# EAGLE design midi_block (EAGLE 6.6.0)
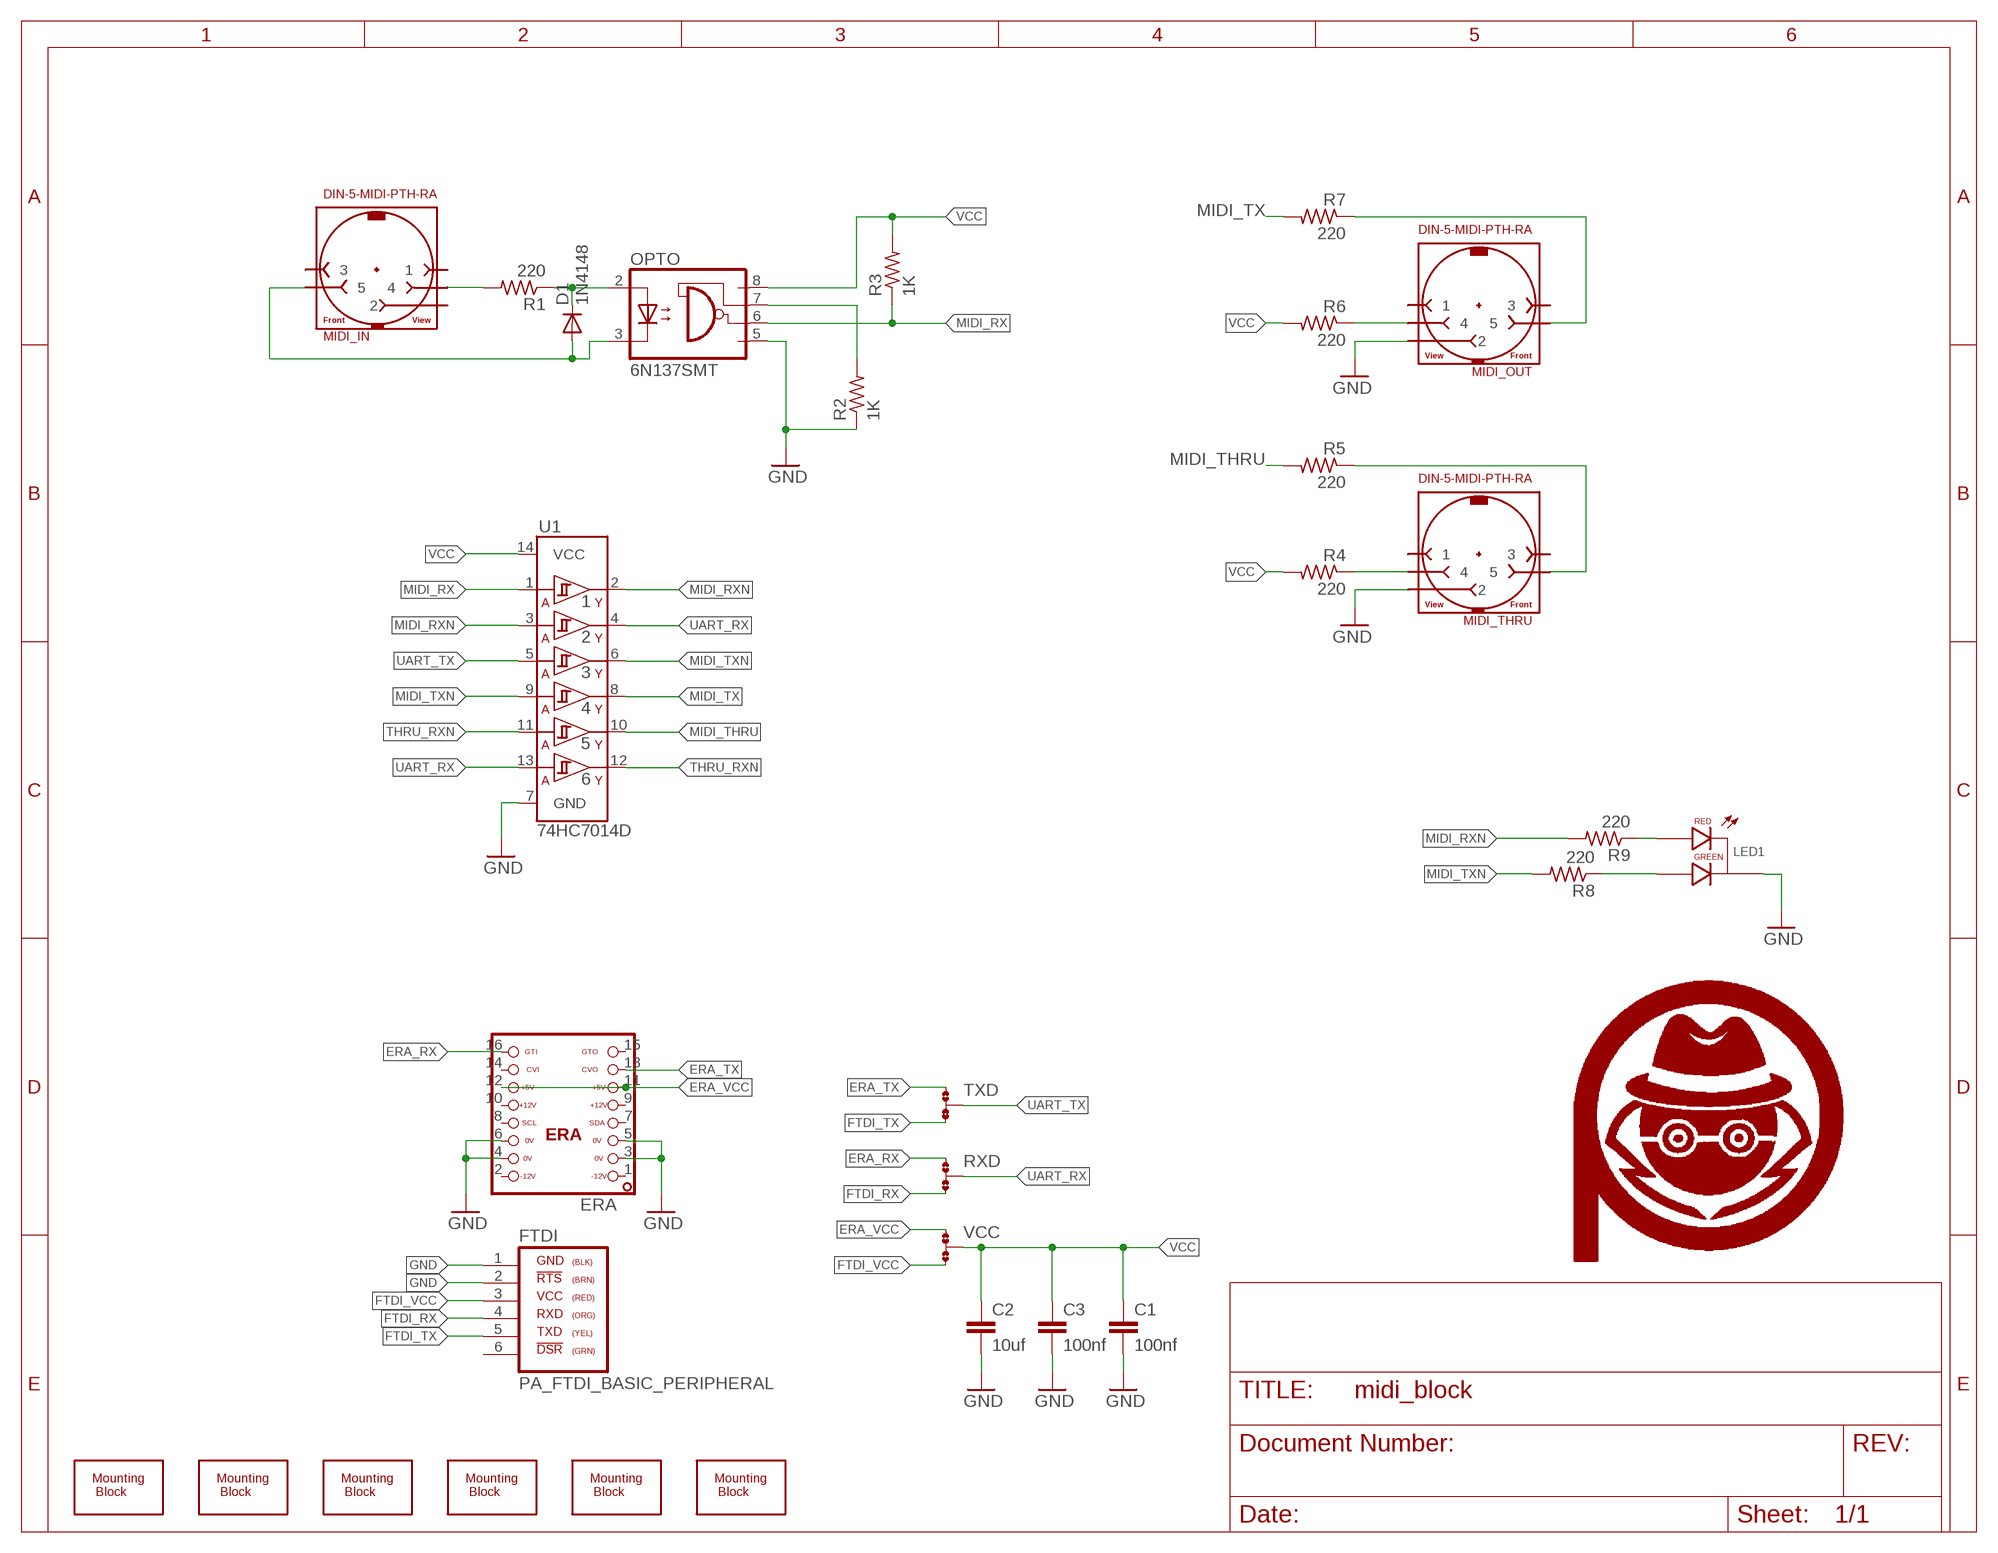
[diagram p0: schematic, sheet 1]

## Parts
C1  100nf  CAP0603-CAP  [0603-CAP]
C2  10uf  CAP0603-CAP  [0603-CAP]
C3  100nf  CAP0603-CAP  [0603-CAP]
D1  1N4148  DIODE-SOD323-W  [SOD323-W]
ERA  ERA-SHROUD  [ERA]
FTDI  PA_FTDI_BASIC_PERIPHERAL  [PA_PMOD_SIL_MALE]
LED1  LED-RG-CC-PTH-G18500  [LED-RG-PANEL]
MIDI_IN  DIN-5-MIDI-PTH-RA  [DIN-5-PTH-RA-SUPPORT]
MIDI_OUT  DIN-5-MIDI-PTH-RA  [DIN-5-PTH-RA-SUPPORT]
MIDI_THRU  DIN-5-MIDI-PTH-RA  [DIN-5-PTH-RA-SUPPORT]
OPTO  6N137SMT  [DIL8-SMD]
R1  220  R-US_R0603  [R0603]
R2  1K  R-US_R0603  [R0603]
R3  1K  R-US_R0603  [R0603]
R4  220  R-US_R0603  [R0603]
R5  220  R-US_R0603  [R0603]
R6  220  R-US_R0603  [R0603]
R7  220  R-US_R0603  [R0603]
R8  220  R-US_R0603  [R0603]
R9  220  R-US_R0603  [R0603]
RXD  JMP-3-NO-PTH  [JMP-3-NO-PTH-2.54]
TXD  JMP-3-NO-PTH  [JMP-3-NO-PTH-2.54]
U1  74HC7014D  [SOIC-14]
U$1  PCB-MB-SIDE  [PCB-MB-01-SIDE]
U$2  PCB-MB-SIDE  [PCB-MB-01-SIDE]
U$3  PCB-MB-SIDE  [PCB-MB-01-SIDE]
U$4  PCB-MB-SIDE  [PCB-MB-01-SIDE]
U$5  PA_LOGO_SYMMED  [PA_LOGO_AGENT_MED_SYM]
U$6  PA_LOGO_SYMMED  [PA_LOGO_AGENT_MED_SYM]
U$7  PCB-MB-SIDE  [PCB-MB-01-SIDE]
U$8  PCB-MB-SIDE  [PCB-MB-01-SIDE]
VCC  JMP-3-NO-PTH  [JMP-3-NO-PTH-2.54]

## Nets
CL_IN: MIDI_IN.4 R1.2
ERA_RX: ERA.16 RXD.1
ERA_TX: ERA.13 TXD.1
ERA_VCC: ERA.11 ERA.12 VCC.1
FTDI_RX: FTDI.4 RXD.3
FTDI_TX: FTDI.5 TXD.3
FTDI_VCC: FTDI.3 VCC.3
GND: C1.2 C2.2 C3.2 ERA.3 ERA.4 ERA.5 ERA.6 FTDI.1 FTDI.2 LED1.CC(CATHODE) MIDI_OUT.2 MIDI_THRU.2 OPTO.5(GND) R2.1 U1.7(GND)
MIDI_IN: D1.A MIDI_IN.5 OPTO.3(C)
MIDI_OUT: MIDI_OUT.5 R7.1
MIDI_OUT1: MIDI_THRU.5 R5.1
MIDI_RX: OPTO.6(VO) R3.1 U1.1(1A)
MIDI_RXN: R9.2 U1.2(1Y) U1.3(2A)
MIDI_THRU: R5.2 U1.10(5Y)
MIDI_TX: R7.2 U1.8(4Y)
MIDI_TXN: R8.2 U1.6(3Y) U1.9(4A)
N$1: LED1.RED(RED_CATHODE) R9.1
N$2: LED1.GREEN(GREEN_CATHODE) R8.1
N$3: MIDI_THRU.4 R4.1
N$4: OPTO.7(VE) R2.2
N$8: D1.C OPTO.2(A) R1.1
N$13: MIDI_OUT.4 R6.1
THRU_RXN: U1.11(5A) U1.12(6Y)
UART_RX: RXD.2 U1.4(2Y) U1.13(6A)
UART_TX: TXD.2 U1.5(3A)
VCC: C1.1 C2.1 C3.1 OPTO.8(VCC) R3.2 R4.2 R6.2 U1.14(VCC) VCC.2
Unconnected: ERA.1 ERA.2 ERA.7 ERA.8 ERA.9 ERA.10 ERA.14 ERA.15 FTDI.6 MIDI_IN.1 MIDI_IN.2 MIDI_IN.3 MIDI_OUT.1 MIDI_OUT.3 MIDI_THRU.1 MIDI_THRU.3

## Library data of the parts
C1-C3 = halcyonmod_Passives:CAP: Capacitor Standard 0603 ceramic capacitor, and 0.1" leaded capacitor.
D1 = diode:DIODE-: DIODE
ERA = ERA:ERA: EuroRack2 - Backplane Connector
FTDI = PatternAgents-Interface:PA_FTDI_BASIC_PERIPHERAL: PatternAgents FTDI UART BASIC Pattern Pinout for Peripherals that connect to the "BASIC" FTDI USB-UART adaptor from Sparkfun and others. Source LBR : http://www.patternagents.com Github : https://github.com/patternagents Source Data : http://www.sparkfun.com/datasheets/DevTools/Arduino/FTDI%20Basic-v21-5V.pdf PA Pattern License : http://creativecommons.org/licenses/by-sa/4.0/ (Creative Commons 4.0) THIS SOFTWARE IS PROVIDED BY THE CONTRIBUTORS "AS IS" AND WITHOUT ANY EXPRESS OR IMPLIED WARRANTIES, INCLUDING, BUT NOT LIMITED TO, THE IMPLIED WARRANTIES OF MERCHANTABILITY AND FITNESS FOR A PARTICULAR PURPOSE ARE DISCLAIMED. IN NO EVENT SHALL THE COPYRIGHT OWNER OR CONTRIBUTORS BE LIABLE FOR ANY DIRECT, INDIRECT, INCIDENTAL, SPECIAL, EXEMPLARY, OR CONSEQUENTIAL DAMAGES (INCLUDING, BUT NOT LIMITED TO, PROCUREMENT OF SUBSTITUTE GOODS OR SERVICES; LOSS OF USE, DATA, OR PROFITS; OR BUSINESS INTERRUPTION) HOWEVER CAUSED AND ON ANY THEORY OF LIABILITY, WHETHER IN CONTRACT, STRICT LIABILITY, OR TORT (INCLUDING NEGLIGENCE OR OTHERWISE) ARISING IN ANY WAY OUT OF THE USE OF THIS SOFTWARE, EVEN IF ADVISED OF THE POSSIBILITY OF SUCH DAMAGE.
LED1 = halcyonmod_Optoelectronics:LED-RG-CC-PTH: LED Red/Green Common Cathode Pin Through Hole
MIDI_IN MIDI_OUT MIDI_THRU = oXo_connectors:DIN-5-MIDI: DIN-5 (MIDI) connector
OPTO = og-optocouplers:6N137: MOTOROLA OPTO COUPLER
R1-R9 = rcl:R-US_: RESISTOR, American symbol
RXD TXD VCC = PatternAgents-ProtoPads:JMP-3-NO: Three Terminal Jumper - Normally Open All Pads Open (unconnected) PatternAgents ProtoPads Library Schematic and PCB layout libraries for design patterns by PatternAgents. For the CADSoft Eagle CAD program : http://www.cadsoftusa.com/download-eagle/ Source LBR : http://www.patternagents.com Github : https://github.com/PatternAgents License : http://creativecommons.org/licenses/by-sa/4.0/ (Creative Commons 4.0) THIS SOFTWARE IS PROVIDED BY THE CONTRIBUTORS "AS IS" AND WITHOUT ANY EXPRESS OR IMPLIED WARRANTIES, INCLUDING, BUT NOT LIMITED TO, THE IMPLIED WARRANTIES OF MERCHANTABILITY AND FITNESS FOR A PARTICULAR PURPOSE ARE DISCLAIMED. IN NO EVENT SHALL THE COPYRIGHT OWNER OR CONTRIBUTORS BE LIABLE FOR ANY DIRECT, INDIRECT, INCIDENTAL, SPECIAL, EXEMPLARY, OR CONSEQUENTIAL DAMAGES (INCLUDING, BUT NOT LIMITED TO, PROCUREMENT OF SUBSTITUTE GOODS OR SERVICES; LOSS OF USE, DATA, OR PROFITS; OR BUSINESS INTERRUPTION) HOWEVER CAUSED AND ON ANY THEORY OF LIABILITY, WHETHER IN CONTRACT, STRICT LIABILITY, OR TORT (INCLUDING NEGLIGENCE OR OTHERWISE) ARISING IN ANY WAY OUT OF THE USE OF THIS SOFTWARE, EVEN IF ADVISED OF THE POSSIBILITY OF SUCH DAMAGE.
U1 = SparkFun-DigitalIC:74HC7014D: The 74HC7014 is a hex buffer with precision Schmitt-trigger inputs. The precisely defined trigger levels are lying in a window between (0.55 x VCC) and (0.65 x VCC). It makes the circuit suitable to operate in a highly noisy environment. Input shorts are allowed to -1.5 V and +16 V without disturbing other channels. Inputs include clamp diodes that enable the use of current limiting resistors to interface inputs to voltages in excess of VCC. Schmitt trigger inputs transform slowly changing input signals into sharply defined jitter-free output signals.; PROD_ID: IC-12527
U$1-U$4 U$7 U$8 = halcyonmod_Hardware:PCB-MB: Mounting Block Hardware Attaches two PCB's at a Right Angle using #4 Self-Threading Screws Source: http://www.essentracomponents.com.sg/images-line/pdfs/PCB-MB.pdf
U$5 U$6 = PatternAgents-Logos:PA_LOGO_SYM: PatternAgents Logo Symbol Trademark : PatternAgents, LLC Github : https://github.com/PatternAgents/PCB_Libraries License : http://creativecommons.org/licenses/by-sa/3.0/ (Creative Commons 3.0) THIS SOFTWARE IS PROVIDED BY THE CONTRIBUTORS "AS IS" AND WITHOUT ANY EXPRESS OR IMPLIED WARRANTIES, INCLUDING, BUT NOT LIMITED TO, THE IMPLIED WARRANTIES OF MERCHANTABILITY AND FITNESS FOR A PARTICULAR PURPOSE ARE DISCLAIMED. IN NO EVENT SHALL THE COPYRIGHT OWNER OR CONTRIBUTORS BE LIABLE FOR ANY DIRECT, INDIRECT, INCIDENTAL, SPECIAL, EXEMPLARY, OR CONSEQUENTIAL DAMAGES (INCLUDING, BUT NOT LIMITED TO, PROCUREMENT OF SUBSTITUTE GOODS OR SERVICES; LOSS OF USE, DATA, OR PROFITS; OR BUSINESS INTERRUPTION) HOWEVER CAUSED AND ON ANY THEORY OF LIABILITY, WHETHER IN CONTRACT, STRICT LIABILITY, OR TORT (INCLUDING NEGLIGENCE OR OTHERWISE) ARISING IN ANY WAY OUT OF THE USE OF THIS SOFTWARE, EVEN IF ADVISED OF THE POSSIBILITY OF SUCH DAMAGE.

## Board
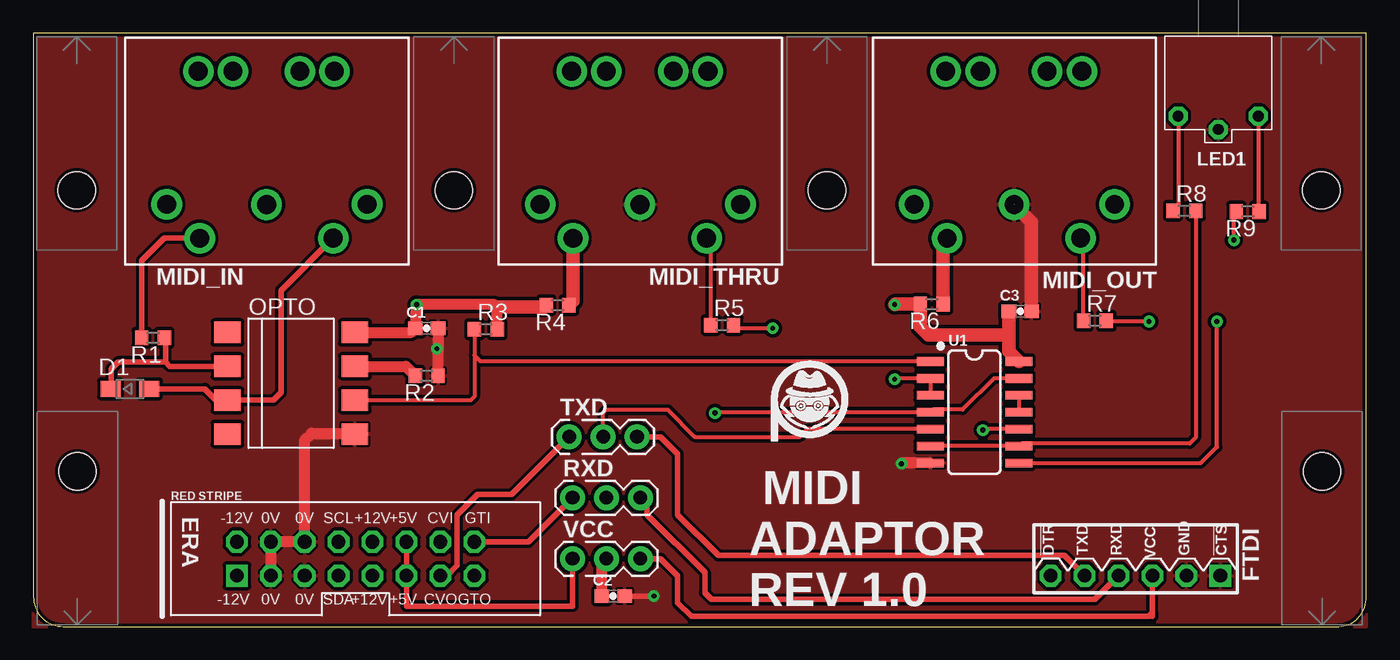
[diagram p1: board, top side]
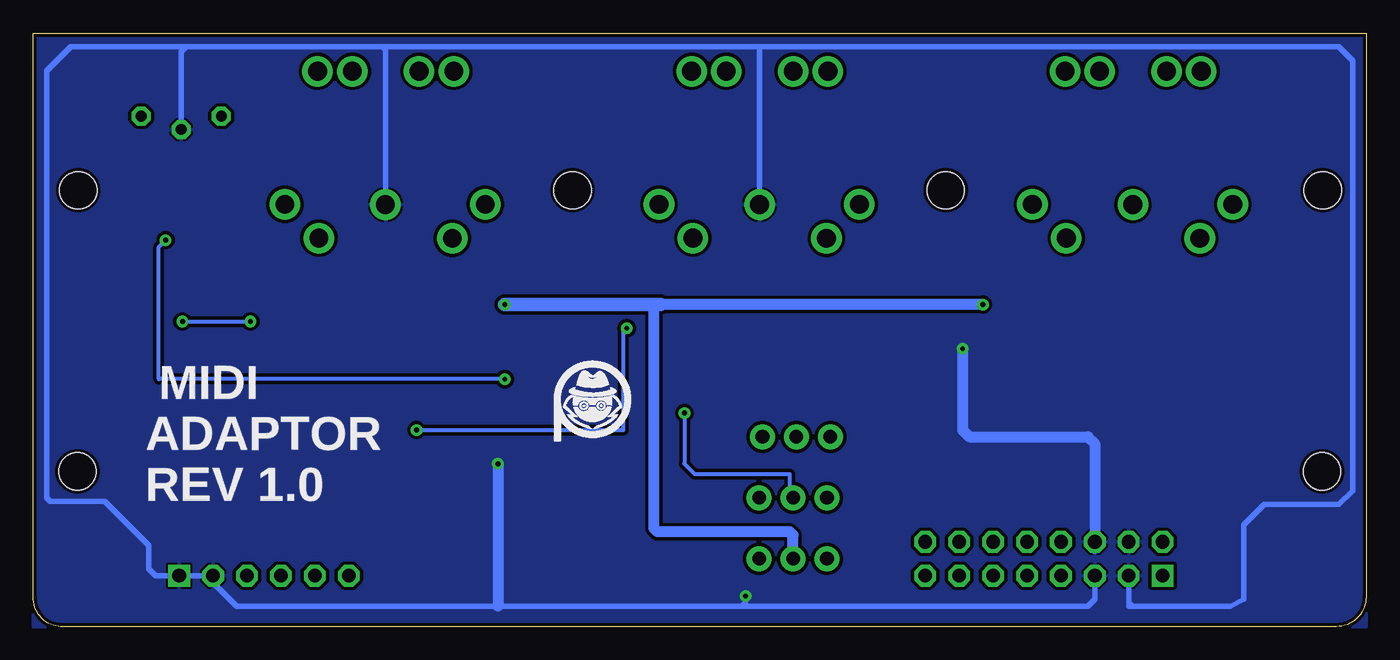
[diagram p2: board, bottom side, seen from below]

Size 99.82 x 44.45 mm. Coordinates in mm from the lower left corner, seen from the top.
Outline: 0,44.45 0,2.24 arc90 2.24,0 97.76,0 arc90 99.82,2.23 99.82,44.45 0,44.45
Copper layers (1*16): Top 0.035mm / dielectric 1.5mm / Bottom 0.035mm
Design rules "PatternAgents_7mil": minimum track width 7mil, minimum drill 14mil, track to track 7mil, track to pad 7mil, pad to pad 7mil, via to via 7mil, smd to smd 7mil, copper to edge 7mil, drill to drill 7mil, minimum pad ring 12mil, minimum via ring 10mil, stop-mask expansion 4mil, vias tented up to drill 25mil, thermal gap 7mil

### Footprints (pad centres in the part's own frame; a part is rotated, then mirrored left to right if it is on the bottom)
0603-CAP = smd 1.1 x 1: 1 -0.85,0; 2 0.85,0
SOD323-W = smd 1.5 x 1.2: A 1.45,0; C -1.45,0
ERA = drill 1.016 square: 1 -8.89,-1.27 | drill 1.016 octagon: 2 -8.89,1.27; 3 -6.35,-1.27; 4 -6.35,1.27; 5 -3.81,-1.27; 6 -3.81,1.27; 7 -1.27,-1.27; 8 -1.27,1.27; 9 1.27,-1.27; 10 1.27,1.27; 11 3.81,-1.27; 12 3.81,1.27; 13 6.35,-1.27; 14 6.35,1.27; 15 8.89,-1.27; 16 8.89,1.27
PA_PMOD_SIL_MALE = drill 1.016 square: 1 1.27,6.35 | drill 1.016 octagon: 2 1.27,3.81; 3 1.27,1.27; 4 1.27,-1.27; 5 1.27,-3.81; 6 1.27,-6.35
LED-RG-PANEL = drill 0.8 octagon: CC 0,3.5; GREEN 3,2.5; RED -3,2.5
DIN-5-PTH-RA-SUPPORT = drill 1.4 pad 2.286: 1 7.54,3.6; 2 0.06,3.61; 3 -7.47,3.6; 4 5.07,6.13; 5 -4.93,6.12; SR1 -5.03,-6.382; SR2 -2.43,-6.382; SR3 2.57,-6.382; SR4 5.178,-6.382
DIL8-SMD = smd 1.6 x 2: 1 -3.81,-4.77; 2 -1.27,-4.77; 3 1.27,-4.77; 4 3.81,-4.77; 5 3.81,4.77; 6 1.27,4.77; 7 -1.27,4.77; 8 -3.81,4.77
R0603 = smd 1 x 1.1: 1 -0.85,0; 2 0.85,0
JMP-3-NO-PTH-2.54 = drill 1.016 pad 1.88: 1 0,0; 2 2.54,0; 3 5.08,0
SOIC-14 = smd 0.66 x 2.032: 1 -4.445,-3.315; 2 -3.175,-3.315; 3 -1.905,-3.315; 4 -0.635,-3.315; 5 0.635,-3.315; 6 1.905,-3.315; 7 3.175,-3.315; 8 3.175,3.315; 9 1.905,3.315; 10 0.635,3.315; 11 -0.635,3.315; 12 -1.905,3.315; 13 -3.175,3.315; 14 -4.445,3.315
PCB-MB-01-SIDE = hole 2.8: 3.5,0

### Placement (x,y rotation side)
C1  29.46,22.35 0 top
C2  43.43,2.29 0 top
C3  73.91,23.62 0 top
D1  7.23,17.81 0 top
ERA  24.13,5.08 0 top
FTDI  82.55,5.08 270 top
LED1  88.75,40.75 180 top
MIDI_IN  17.53,35.23 180 top
MIDI_OUT  73.51,35.23 180 top
MIDI_THRU  45.49,35.23 180 top
OPTO  19.3,18.24 270 top
R1  8.96,21.64 180 top
R2  29.46,18.8 180 top
R3  33.89,22.29 0 top
R4  39.26,24.08 180 top
R5  51.59,22.59 0 top
R6  67.29,24.16 180 top
R7  79.51,22.92 0 top
R8  86.21,31.16 0 top
R9  90.95,31.1 180 top
RXD  40.39,9.65 0 top
TXD  40.13,14.22 0 top
U1  70.49,15.43 270 top
U$1  3.25,36.2 270 top
U$2  31.5,36.2 270 top
U$3  59.44,36.2 270 top
U$4  96.47,36.2 270 top
U$5  57.91,16.51 0 bottom
U$6  58.17,16.51 0 top
U$7  3.3,8.13 90 top
U$8  96.52,8.13 90 top
VCC  40.39,5.08 0 top

### Tracks (layer width: path | path; a pad name or v marks a point on that pad's centre or on a via)
CL_IN
  Top 0.406: MIDI_IN.4 9.8,29.1 8.13,27.43 8.13,21.66 R1.2
ERA_RX
  Top 0.406: ERA.16 37.08,6.35 RXD.1
ERA_TX
  Top 0.406: ERA.13 30.99,3.81 31.75,4.57 31.75,8.38 33.27,9.91 35.81,9.91 TXD.1
ERA_VCC
  Top 0.406: ERA.12 ERA.11 27.94,1.52 40.39,1.52 VCC.1
FTDI_RX
  Top 0.406: RXD.3 45.72,9.65 45.97,9.4 45.97,8.38 50.29,4.06 50.29,2.54 50.8,2.03 79.5,2.03 FTDI.4
FTDI_TX
  Top 0.406: TXD.3 46.99,14.22 48.26,12.95 48.26,8.38 51.31,5.33 77.22,5.33 FTDI.5
FTDI_VCC
  Top 0.406: 83.82,0.76 83.82,1.02 | 83.82,1.02 FTDI.3 | VCC.3 46.99,5.08 48.26,3.81 48.26,1.78 49.28,0.76 83.57,0.76 83.82,1.02
GND  (via drill 0.36)
  Top 0.406: v46.48,2.29 C2.2
  Top 0.813: OPTO.5 24.12,14.48 20.83,14.48 20.32,13.97 ERA.6 ERA.4 ERA.3 | C1.2 30.31,20.92 v30.23,20.83 30.31,20.74 R2.1 | U1.7 65.08,12.25 v65.02,12.19
  Top 1.016: C3.2 74.76,30.3 MIDI_OUT.2
  Bottom 0.406: 86.87,3.81 FTDI.1 90.68,3.81 91.19,4.32 91.19,6.1 94.49,9.4 98.55,9.4 98.81,9.65 98.81,41.66 97.03,43.43 88.39,43.43 | FTDI.2 86.87,3.81 | 88.39,43.43 73.66,43.43 | 73.66,43.43 45.47,43.43 | 45.47,43.43 2.03,43.43 1.02,42.42 1.02,10.16 2.03,9.14 7.62,9.14 9.14,7.62 9.14,2.03 10.16,1.52 17.53,1.52 | 17.53,1.52 17.78,1.52 17.78,1.78 | ERA.3 17.78,1.78 | 17.78,1.78 17.53,1.52 | MIDI_THRU.2 45.43,43.4 45.47,43.43 | MIDI_OUT.2 73.45,43.22 73.66,43.43 | LED1.CC 88.75,43.08 88.39,43.43 | ERA.5 20.32,2.03 20.83,1.52 46.74,1.52 | 46.74,1.52 65.02,1.52 84.58,1.52 86.87,3.81 | v46.48,2.29 46.48,1.78 46.74,1.52
  Bottom 0.813: v30.23,20.83 30.23,14.73 29.72,14.22 20.83,14.22 20.32,13.72 20.32,5.84 | v65.02,12.19 65.02,1.52
  pour Top (isolate 0.254, hatched): 0,0 0,44.45 99.82,44.45 99.82,0
  pour Bottom (isolate 0.254, hatched): 0,0 0,44.45 99.82,44.45 99.82,0
MIDI_IN
  Top 0.406: MIDI_IN.5 18.54,25.2 18.54,17.53 17.98,16.97 OPTO.3 14.1,16.54 12.83,17.81 D1.A
MIDI_OUT
  Top 0.305: R7.1 78.66,28.89 MIDI_OUT.5
MIDI_OUT1
  Top 0.305: R5.1 50.74,28.79 MIDI_THRU.5
MIDI_RX
  Top 0.305: OPTO.6 32.77,16.97 33.04,17.24 33.04,20.32 | R3.1 33.04,20.32 | U1.1 33.48,19.87 33.04,20.32
MIDI_RXN  (via drill 0.36)
  Top 0.305: U1.3 U1.2 64.58,18.6 v64.52,18.54 | v89.92,28.96 89.92,30.91 R9.2
  Bottom 0.305: v64.52,18.54 90.42,18.54 90.42,28.45 v89.92,28.96
MIDI_THRU  (via drill 0.36)
  Top 0.305: U1.10 71.18,14.79 v71.12,14.73 | v55.37,22.35 52.68,22.35 R5.2
  Bottom 0.305: v71.12,14.73 55.63,14.73 55.63,22.1 v55.37,22.35
MIDI_TX  (via drill 0.36)
  Top 0.305: U1.8 87.44,12.25 88.65,13.46 v88.65,22.86 | v83.57,22.86 80.42,22.86 R7.2
  Bottom 0.305: v88.65,22.86 v83.57,22.86
MIDI_TXN
  Top 0.305: U1.6 U1.9 74,13.72 86.61,13.72 87.06,14.16 R8.2
N$1
  Top 0.305: LED1.RED 91.75,31.16 R9.1
N$2
  Top 0.305: LED1.GREEN 85.75,31.54 R8.1
N$3
  Top 1.016: MIDI_THRU.4 40.42,24.39 R4.1
N$4
  Top 0.813: OPTO.7 27.9,19.51 R2.2
N$8
  Top 0.406: OPTO.2 10.21,19.51 9.91,19.81 | 9.91,19.81 9.91,21.54 R1.1 | 9.91,19.81 6.35,19.81 5.84,19.3 5.84,17.87 D1.C
N$13
  Top 1.016: R6.1 68.14,28.8 MIDI_OUT.4
THRU_RXN
  Top 0.305: U1.12 U1.11
UART_RX  (via drill 0.36)
  Top 0.305: U1.13 71.94,18.6 69.6,16.26 67.37,16.26 U1.4 51.12,16.06 v51.05,16
  Bottom 0.305: v51.05,16 51.05,12.19 50.29,11.43 43.18,11.43 43.18,9.91 RXD.2
UART_TX
  Top 0.305: TXD.2 42.67,16 42.93,16.26 47.5,16.26 49.53,14.22 57.4,14.22 57.97,14.79 U1.5
VCC  (via drill 0.36)
  Top 0.813: C2.1 42.58,4.74 VCC.2 | OPTO.8 28.31,22.05 C1.1 v28.7,24.13 34.54,24.13 34.74,23.94 R3.2
  Top 1.016: 34.74,23.94 38.27,23.94 R4.2 | v64.52,24.13 64.55,24.16 R6.2 66.44,22.46 67.06,21.84 72.81,21.84 73.06,21.59 | C3.1 73.06,21.59 | 73.06,21.59 73.06,20.61 U1.14
  Bottom 0.813: VCC.2 42.93,6.86 43.18,7.11 53.09,7.11 53.34,7.37 53.34,23.88 53.09,24.13 52.83,24.13 v28.7,24.13
  Bottom 1.016: v64.52,24.13 52.83,24.13

### Text on the board
tPlace: LED1 | !DTR | TXD | RXD | VCC | GND | !CTS | MIDI / ADAPTOR / REV 1.0
bPlace: MIDI / ADAPTOR / REV 1.0